# EAGLE schematic BUZZI-48 (EAGLE 5.11)
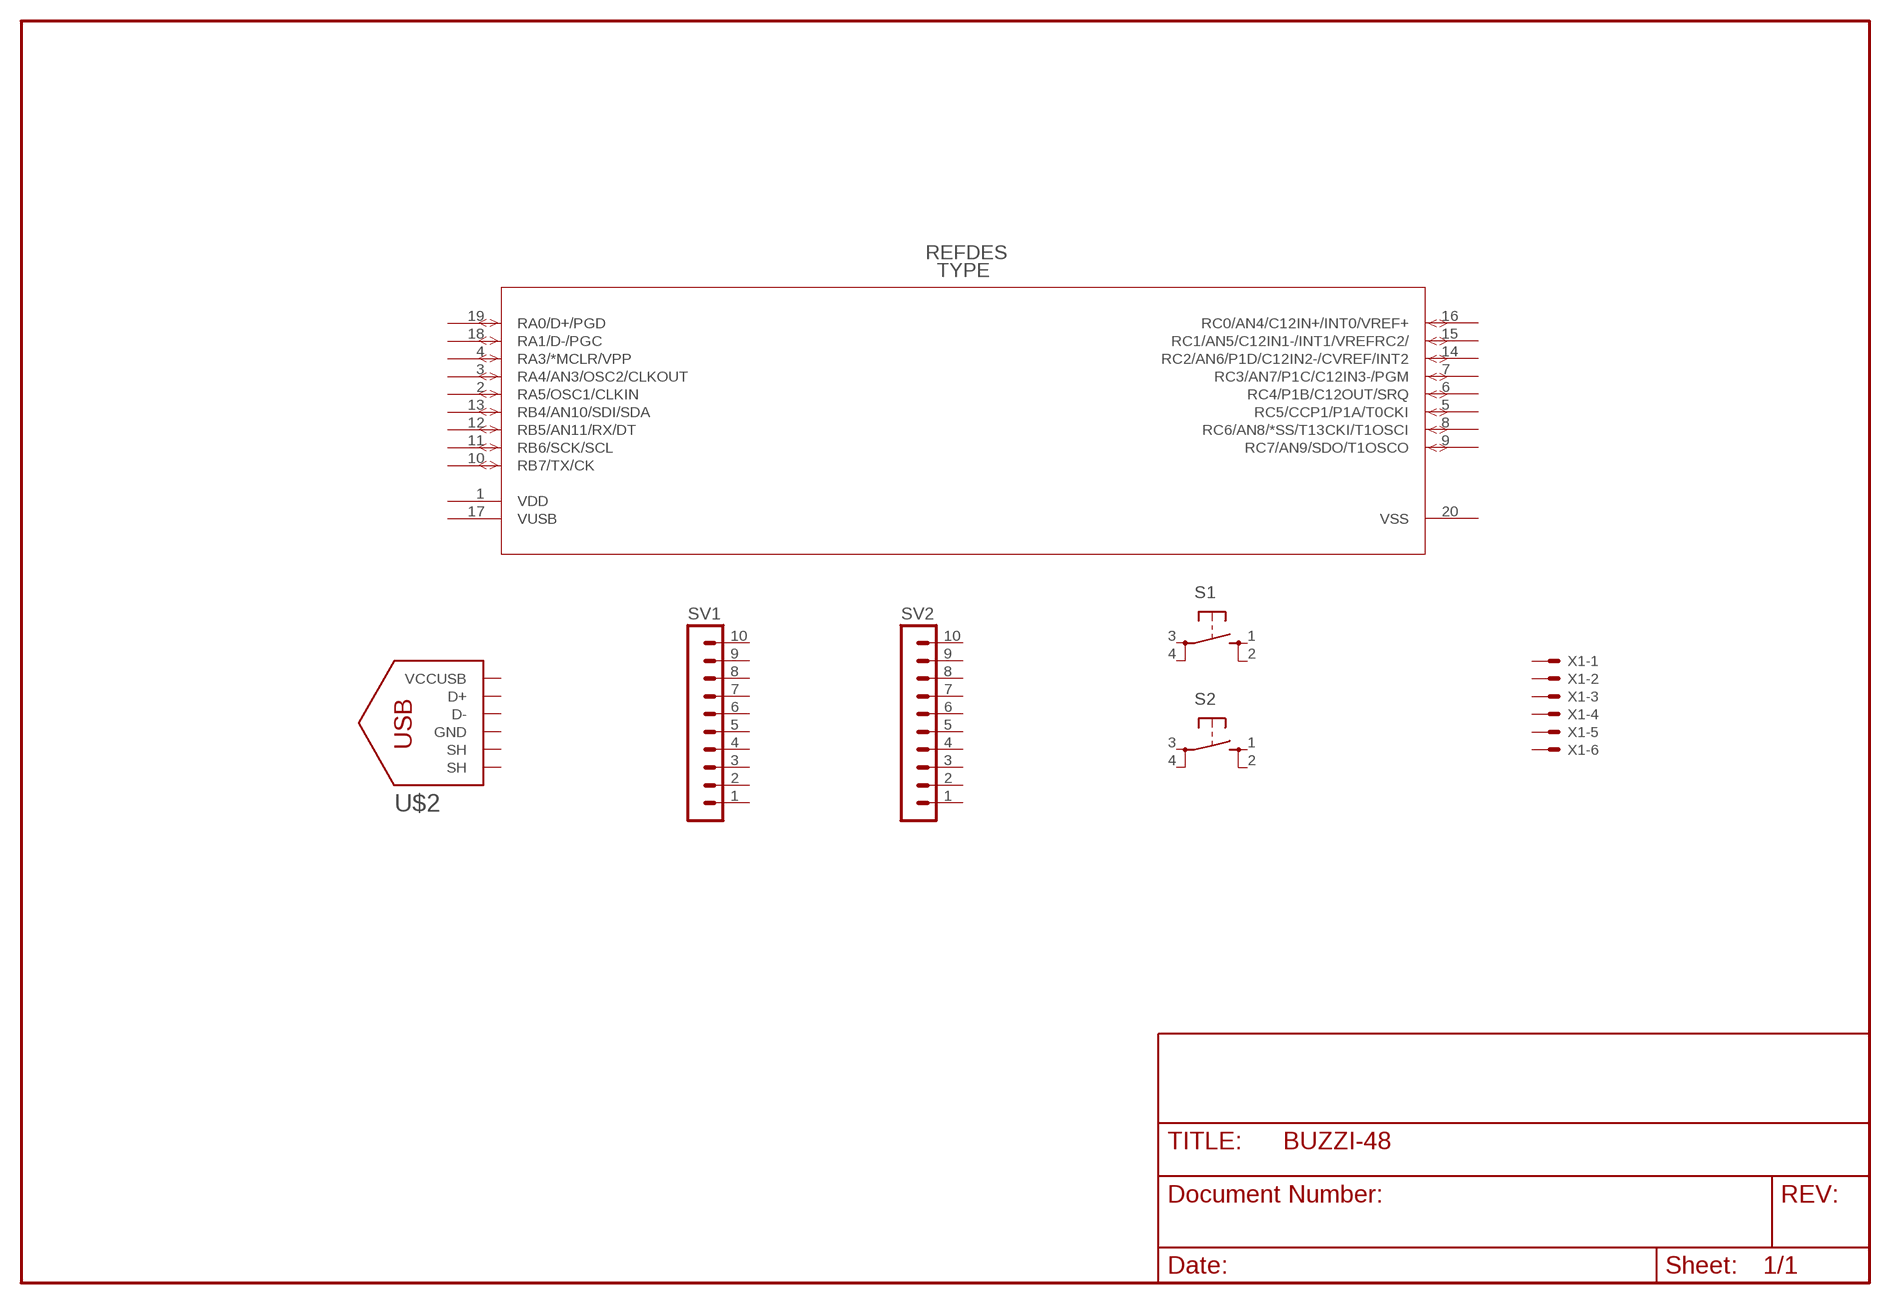
[diagram p0: schematic, sheet 1]

## Parts
S1  10XX  [B3F-10XX]
S2  10XX  [B3F-10XX]
SV1  MA10-1  [MA10-1]
SV2  MA10-1  [MA10-1]
U$1  PIC18F14K50-E-P  [PIC18F14K50-E/P]
U$2  USBCONNMINI-B-HOLE  [USB-MB-H]
X1  22-23-2061  [22-23-2061]
Unconnected: S1.1 S1.2 S1.3 S1.4 S2.1 S2.2 S2.3 S2.4 SV1.1 SV1.2 SV1.3 SV1.4 SV1.5 SV1.6 SV1.7 SV1.8 SV1.9 SV1.10 SV2.1 SV2.2 SV2.3 SV2.4 SV2.5 SV2.6 SV2.7 SV2.8 SV2.9 SV2.10 U$1.1(VDD) U$1.2(RA5/OSC1/CLKIN) U$1.3(RA4/AN3/OSC2/CLKOUT) U$1.4(RA3/*MCLR/VPP) U$1.5(RC5/CCP1/P1A/T0CKI) U$1.6(RC4/P1B/C12OUT/SRQ) U$1.7(RC3/AN7/P1C/C12IN3-/PGM) U$1.8(RC6/AN8/*SS/T13CKI/T1OSCI) U$1.9(RC7/AN9/SDO/T1OSCO) U$1.10(RB7/TX/CK) U$1.11(RB6/SCK/SCL) U$1.12(RB5/AN11/RX/DT) U$1.13(RB4/AN10/SDI/SDA) U$1.14(RC2/AN6/P1D/C12IN2-/CVREF/INT2) U$1.15(RC1/AN5/C12IN1-/INT1/VREFRC2/) U$1.16(RC0/AN4/C12IN+/INT0/VREF+) U$1.17(VUSB) U$1.18(RA1/D-/PGC) U$1.19(RA0/D+/PGD) U$1.20(VSS) U$2.D+ U$2.D- U$2.GND U$2.GND@1(SH) U$2.GND@2(SH) U$2.VBUS(VCCUSB) X1.1 X1.2 X1.3 X1.4 X1.5 X1.6

## Library data of the parts
S1 S2 = turbod3:10XX
SV1 SV2 = con-lstb:MA10-1: PIN HEADER; OC_FARNELL: unknown; OC_NEWARK: unknown
U$1 = pic18f-1K50:PIC18F14K50-E-P
U$2 = turbod3:USBCONN
X1 = con-molex:22-23-2061: .100" (2.54mm) Center Header - 6 Pin; MF: MOLEX; MPN: 22-23-2061; OC_FARNELL: 1462922; OC_NEWARK: 27C1933